# Altium schematic sheet PowerSupplies.SchDoc: Shepherd - Power Supplies
size 381 x 241 mm; Author: Ingmar; CompanyName: NES Lab / TU Dresden; DocumentNumber: 2; SheetNumber: 2; SheetTotal: 8
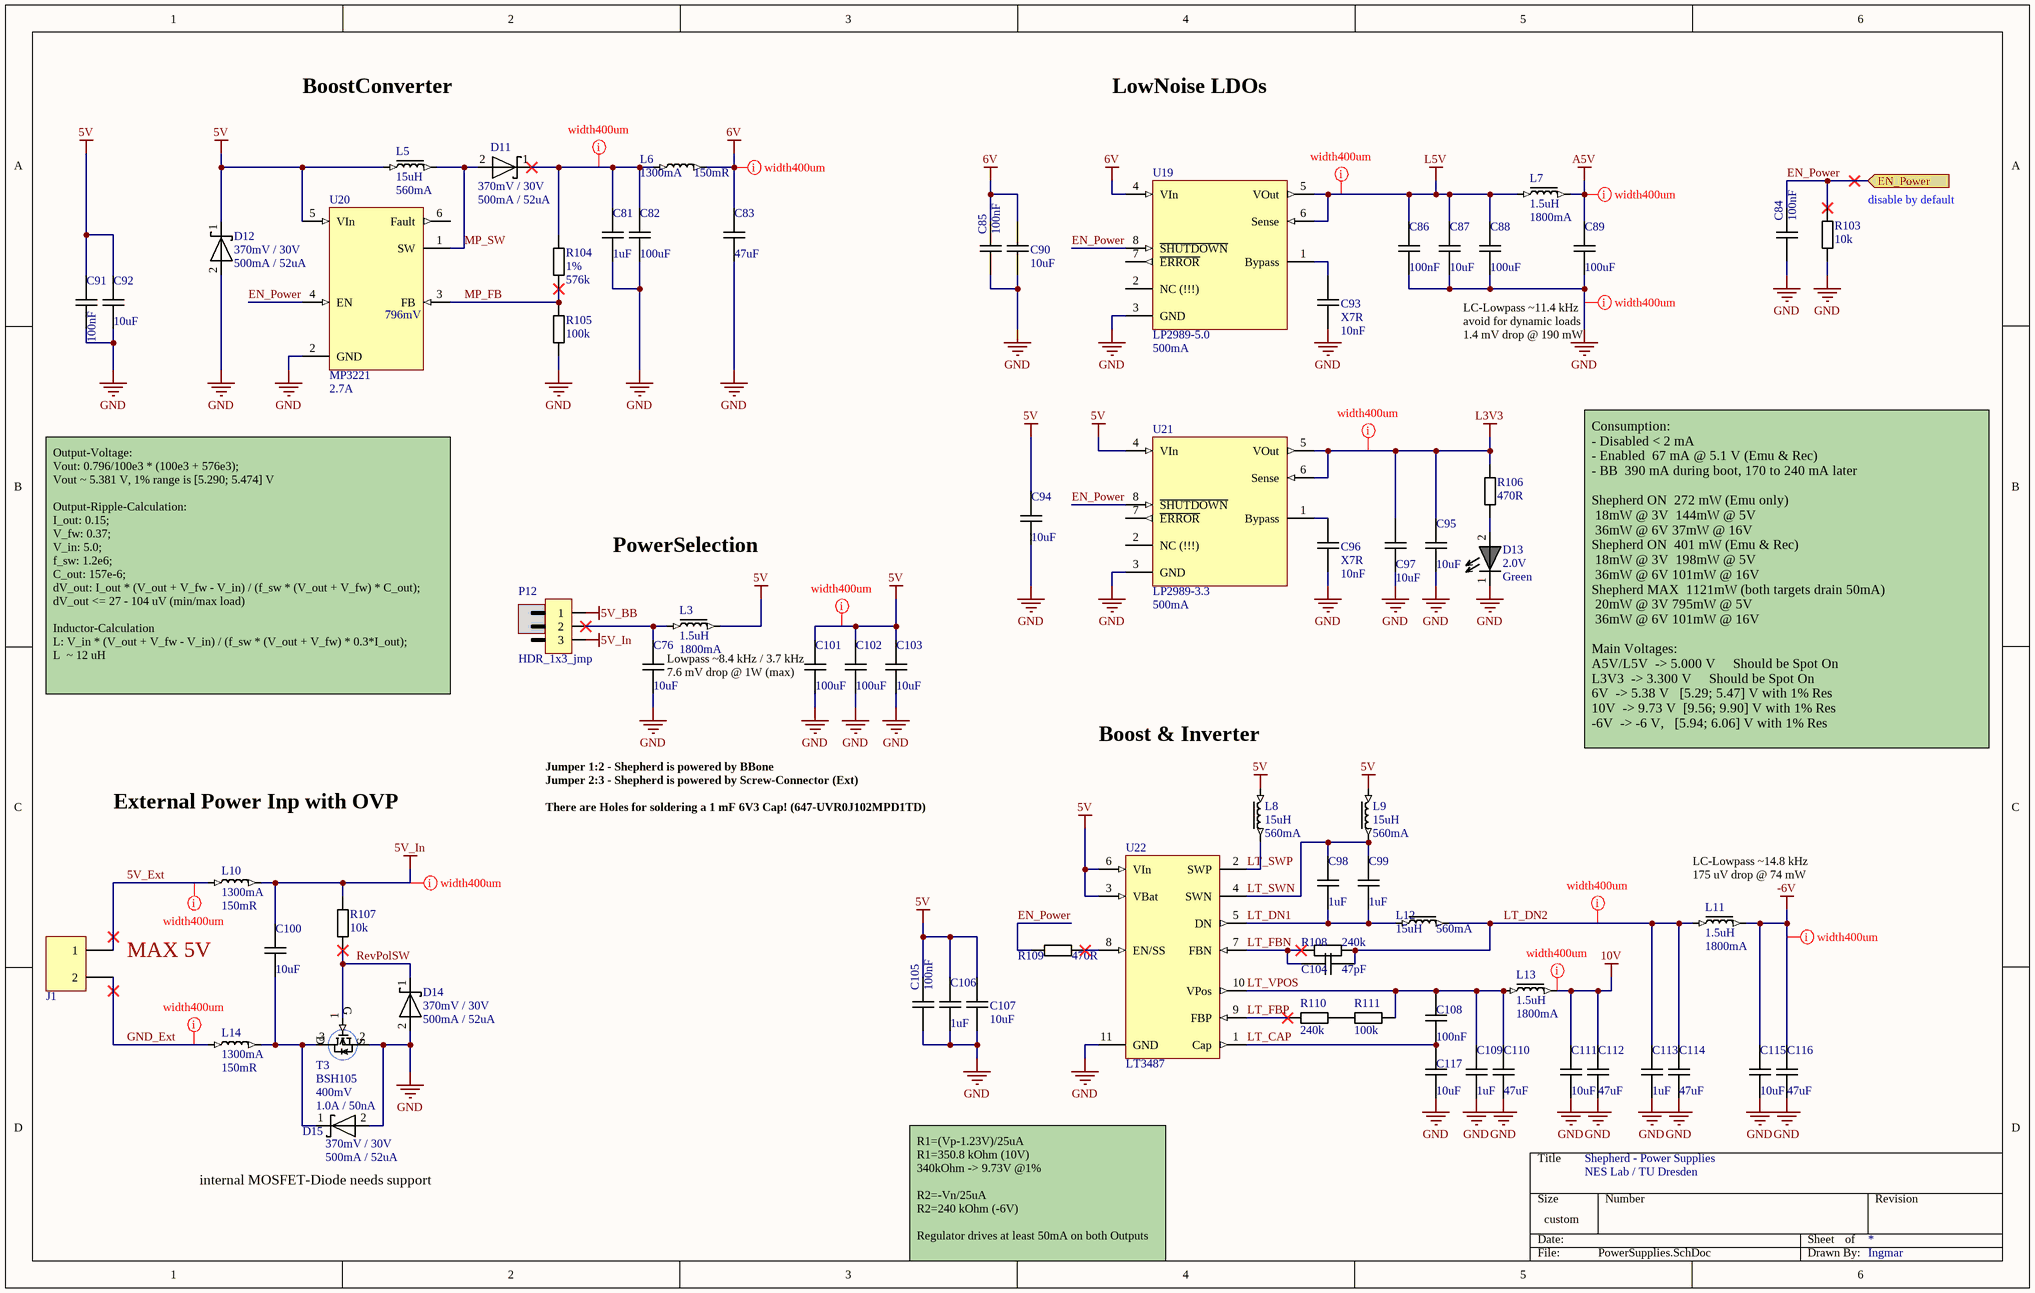
[diagram p0: PowerSupplies.SchDoc]

## Parts
C76  value 10uF  [CAPC1608X09]  (hidden comment: C_0603_10uF_16V)
C81  value 1uF  [CAPC1005X06]  (hidden comment: C_0402_1uF_25V)
C82  value 100uF  [CAPC3216X18]  (hidden comment: C_1206_100uF_6V3)
C83  value 47uF  [CAPC3216X18]  (hidden comment: C_1206_47uF_10V)
C84  value 100nF  [CAPC1005X06]  (hidden comment: C_0402_100nF_16V)
C85  value 100nF  [CAPC1005X06]  (hidden comment: C_0402_100nF_16V)
C86  value 100nF  [CAPC1005X06]  (hidden comment: C_0402_100nF_16V)
C87  value 10uF  [CAPC1608X09]  (hidden comment: C_0603_10uF_16V)
C88  value 100uF  [CAPC3216X18]  (hidden comment: C_1206_100uF_6V3)
C89  value 100uF  [CAPC3216X18]  (hidden comment: C_1206_100uF_6V3)
C90  value 10uF  [CAPC1608X09]  (hidden comment: C_0603_10uF_16V)
C91  value 100nF  [CAPC1005X06]  (hidden comment: C_0402_100nF_16V)
C92  value 10uF  [CAPC1608X09]  (hidden comment: C_0603_10uF_16V)
C93  value 10nF  Dielectric: X7R  [CAPC1005X06]  (hidden comment: C_0402_10nF_25V)
C94  value 10uF  [CAPC1608X09]  (hidden comment: C_0603_10uF_16V)
C95  value 10uF  [CAPC1608X09]  (hidden comment: C_0603_10uF_16V)
C96  value 10nF  Dielectric: X7R  [CAPC1005X06]  (hidden comment: C_0402_10nF_25V)
C97  value 10uF  [CAPC1608X09]  (hidden comment: C_0603_10uF_16V)
C98  value 1uF  [CAPC1005X06]  (hidden comment: C_0402_1uF_25V)
C99  value 1uF  [CAPC1005X06]  (hidden comment: C_0402_1uF_25V)
C100  value 10uF  [CAPC1608X09]  (hidden comment: C_0603_10uF_16V)
C101  value 100uF  [CAPC3216X18]  (hidden comment: C_1206_100uF_6V3)
C102  value 100uF  [CAPC3216X18]  (hidden comment: C_1206_100uF_6V3)
C103  value 10uF  [CAPC1608X09]  (hidden comment: C_0603_10uF_16V)
C104  value 47pF  [CAPC1005X06]  (hidden comment: C_0402_47pF_50V)
C105  value 100nF  [CAPC1005X06]  (hidden comment: C_0402_100nF_16V)
C106  value 1uF  [CAPC1005X06]  (hidden comment: C_0402_1uF_25V)
C107  value 10uF  [CAPC1608X09]  (hidden comment: C_0603_10uF_16V)
C108  value 100nF  [CAPC1005X06]  (hidden comment: C_0402_100nF_16V)
C109  value 1uF  [CAPC1005X06]  (hidden comment: C_0402_1uF_25V)
C110  value 47uF  [CAPC3216X18]  (hidden comment: C_1206_47uF_10V)
C111  value 10uF  [CAPC1608X09]  (hidden comment: C_0603_10uF_16V)
C112  value 47uF  [CAPC3216X18]  (hidden comment: C_1206_47uF_10V)
C113  value 1uF  [CAPC1005X06]  (hidden comment: C_0402_1uF_25V)
C114  value 47uF  [CAPC3216X18]  (hidden comment: C_1206_47uF_10V)
C115  value 10uF  [CAPC1608X09]  (hidden comment: C_0603_10uF_16V)
C116  value 47uF  [CAPC3216X18]  (hidden comment: C_1206_47uF_10V)
C117  value 10uF  [CAPC1608X09]  (hidden comment: C_0603_10uF_16V)
D11  value 370mV / 30V  I_max: 500mA / 52uA  [SODFL160X70-2N]  (hidden comment: D_SOD523_370mV_500mA)
D12  value 370mV / 30V  I_max: 500mA / 52uA  [SODFL160X70-2N]  (hidden comment: D_SOD523_370mV_500mA)
D13  value Green  V_max: 2.0V  [DIOM1608X02N Green]  (hidden comment: D_LED_0603_Green)
D14  value 370mV / 30V  I_max: 500mA / 52uA  [SODFL160X70-2N]  (hidden comment: D_SOD523_370mV_500mA)
D15  value 370mV / 30V  I_max: 500mA / 52uA  [SODFL160X70-2N]  (hidden comment: D_SOD523_370mV_500mA)
J1  J_T1x2_3.5mm_Screw  [P_Phoenix_1984617]  (value not drawn)
L3  value 1.5uH  I_max: 1800mA  [INDP3030X15N]  (hidden comment: NR3015T1R5M)
L5  value 15uH  I_max: 560mA  [INDP3030X15N]  (hidden comment: NR3015T150M)
L6  value 150mR  I_max: 1300mA  [INDC1608X08]  (hidden comment: FB_0603_Z600R_1300mA)
L7  value 1.5uH  I_max: 1800mA  [INDP3030X15N]  (hidden comment: NR3015T1R5M)
L8  value 15uH  I_max: 560mA  [INDP3030X15N]  (hidden comment: NR3015T150M)
L9  value 15uH  I_max: 560mA  [INDP3030X15N]  (hidden comment: NR3015T150M)
L10  value 150mR  I_max: 1300mA  [INDC1608X08]  (hidden comment: FB_0603_Z600R_1300mA)
L11  value 1.5uH  I_max: 1800mA  [INDP3030X15N]  (hidden comment: NR3015T1R5M)
L12  value 15uH  I_max: 560mA  [INDP3030X15N]  (hidden comment: NR3015T150M)
L13  value 1.5uH  I_max: 1800mA  [INDP3030X15N]  (hidden comment: NR3015T1R5M)
L14  value 150mR  I_max: 1300mA  [INDC1608X08]  (hidden comment: FB_0603_Z600R_1300mA)
P12  HDR_1x3_jmp  [P_Pinheader_1x3_R2.54mm_SMD]  (no BOM)
R103  value 10k  [RESC1005X04]  (hidden comment: R_0402_10k)
R104  value 576k  Tolerance: 1%  [RESC1005X04]  (hidden comment: R_0402_576k_1%)
R105  value 100k  [RESC1005X04]  (hidden comment: R_0402_100k_1%)
R106  value 470R  [RESC1005X04]  (hidden comment: R_0402_470R)
R107  value 10k  [RESC1005X04]  (hidden comment: R_0402_10k)
R108  value 240k  [RESC1005X04]  (hidden comment: R_0402_240k_1%)
R109  value 470R  [RESC1005X04]  (hidden comment: R_0402_470R)
R110  value 240k  [RESC1005X04]  (hidden comment: R_0402_240k_1%)
R111  value 100k  [RESC1005X04]  (hidden comment: R_0402_100k_1%)
T3  BSH105  V_min: 400mV  I_max: 1.0A / 50nA  [SOT95P230X110-3N]
U19  LP2989-5.0  I_max: 500mA  [TSOP65P490X110-8N]
U20  MP3221  I_max: 2.7A  [SOT95P280X100-6N]
U21  LP2989-3.3  I_max: 500mA  [TSOP65P490X110-8N]
U22  LT3487  [PSON50P300X100_HS-11N]

## Ports
EN_Power (in)

## Nets
5V: C91.2 C92.2 C94.2 C101.2 C102.2 C103.2 C105.2 C106.1 C107.2 D12.1 L3.2 L5.1 L8.1 L9.1 U20.5(VIn) U21.4(VIn) U22.3(VBat) U22.6(VIn)
5V_BB: P12.1
5V_In: C100.2 L10.2 P12.3 R107.2
6V: C83.2 C85.2 C90.2 L6.2 U19.4(VIn)
10V: C111.2 C112.2 L13.2
-6V: C115.2 C116.2 L11.2
A5V: C89.2 L7.2
GND: C76.1 C81.1 C82.1 C83.1 C84.1 C85.1 C86.1 C87.1 C88.1 C89.1 C90.1 C91.1 C92.1 C93.1 C94.1 C95.1 C96.1 C97.1 C101.1 C102.1 C103.1 C105.1 C106.2 C107.1 C109.1 C110.1 C111.1 C112.1 C113.1 C114.1 C115.1 C116.1 C117.1 D12.2 D13.1 D14.2 D15.2 R103.1 R105.1 T3.2(S) U19.3(GND) U20.2(GND) U21.3(GND) U22.11(GND)
L3V3: C95.2 C97.2 R106.2 U21.5(VOut) U21.6(Sense)
L5V: C86.2 C87.2 C88.2 L7.1 U19.5(VOut) U19.6(Sense)
5V_Ext: J1.1 L10.1
EN_Power: C84.2 R103.2 R109.2 U19.8(~{SHUTDOWN}) U20.4(EN) U21.8(~{SHUTDOWN}) ; port EN_Power
GND_Ext: J1.2 L14.1
LT_CAP: C108.1 C117.2 U22.1(Cap)
LT_DN1: C98.2 C99.1 L12.1 U22.5(DN)
LT_DN2: C104.2 C113.2 C114.2 L11.1 L12.2 R108.2
LT_FBN: C104.1 R108.1 U22.7(FBN)
LT_FBP: R110.1 U22.9(FBP)
LT_SWN: C98.1 C99.2 L9.2 U22.4(SWN)
LT_SWP: L8.2 U22.2(SWP)
LT_VPOS: C108.2 C109.2 C110.2 L13.1 R111.2 U22.10(VPos)
MP_FB: R104.1 R105.2 U20.3(FB)
MP_SW: D11.2 L5.2 U20.1(SW)
RevPolSW: D14.1 R107.1 T3.1(G)
NetC76_2: C76.2 L3.1 P12.2
NetC81_2: C81.2 C82.2 D11.1 L6.1 R104.2
NetC93_2: C93.2 U19.1(Bypass)
NetC96_2: C96.2 U21.1(Bypass)
NetC100_1: C100.1 D15.1 L14.2 T3.3(D)
NetD13_2: D13.2 R106.1
NetR109_1: R109.1 U22.8(EN/SS)
NetR110_2: R110.2 R111.1

Not connected (* = marked no-connect by the designer): U19 2(NC_(!!!)) 7(~{ERROR}); U20 6(Fault); U21 2(NC_(!!!)) 7(~{ERROR})

## Layout directives
rule Width Constraint [Pref Width = 0.4mm    Min Width = 0.4mm    Max Width = 1mm]; rule Supply Nets [Voltage = -6.000]: -6V
rule Width Constraint [Pref Width = 0.4mm    Min Width = 0.4mm    Max Width = 1mm]; rule Supply Nets [Voltage = 9.730]: 10V
rule Width Constraint [Pref Width = 0.4mm    Min Width = 0.4mm    Max Width = 1mm]; rule Supply Nets [Voltage = 5.000]: 5V, 5V_In, A5V, L5V
rule Width Constraint [Pref Width = 0.4mm    Min Width = 0.25mm    Max Width = 1mm]: GND
rule Width Constraint [Pref Width = 0.4mm    Min Width = 0.4mm    Max Width = 1mm]: 5V_Ext, GND_Ext, LT_DN2, NetC81_2
rule Width Constraint [Pref Width = 0.4mm    Min Width = 0.25mm    Max Width = 1mm]; rule Supply Nets [Voltage = 3.300]: L3V3
rule Width Constraint [Pref Width = 0.4mm    Min Width = 0.4mm    Max Width = 1mm]; rule Supply Nets [Voltage = 5.380]: 6V

## Notes on the sheet
- BoostConverter
- LowNoise LDOs
- (near R103) disable by default
- LC-Lowpass ~11.4 kHz
- avoid for dynamic loads
- 1.4 mV drop @ 190 mW
- PowerSelection
- Output-Voltage:
  Vout: 0.796/100e3 * (100e3 + 576e3);
  Vout ~ 5.381 V, 1% range is [5.290; 5.474] V
  Output-Ripple-Calculation:
  I_out: 0.15;
  V_fw: 0.37;
  V_in: 5.0;
  f_sw: 1.2e6;
  C_out: 157e-6;
  dV_out: I_out * (V_out + V_fw - V_in) / (f_sw * (V_out + V_fw) * C_out);
  dV_out <= 27 - 104 uV (min/max load)
  Inductor-Calculation
  L: V_in * (V_out + V_fw - V_in) / (f_sw * (V_out + V_fw) * 0.3*I_out);
  L  ~ 12 uH
- (near C101) Lowpass ~8.4 kHz / 3.7 kHz
- 7.6 mV drop @ 1W (max)
- Jumper 1:2 - Shepherd is powered by BBone
- Boost & Inverter
- Consumption:
  - Disabled < 2 mA
  - Enabled  67 mA @ 5.1 V (Emu & Rec)
  - BB  390 mA during boot, 170 to 240 mA later
  Shepherd ON  272 mW (Emu only)
  18mW @ 3V 	144mW @ 5V
  36mW @ 6V	37mW @ 16V
  Shepherd ON  401 mW (Emu & Rec)
  18mW @ 3V 	198mW @ 5V
  36mW @ 6V	101mW @ 16V
  Shepherd MAX  1121mW (both targets drain 50mA)
  20mW @ 3V	795mW @ 5V
  36mW @ 6V	101mW @ 16V
  Main Voltages:
  A5V/L5V 	-> 5.000 V    	Should be Spot On
  L3V3 	-> 3.300 V    	Should be Spot On
  6V 	-> 5.38 V 		[5.29; 5.47] V with 1% Res
  10V 	-> 9.73 V		[9.56; 9.90] V with 1% Res
  -6V 	-> -6 V, 		[5.94; 6.06] V with 1% Res
- External Power Inp with OVP
- Jumper 2:3 - Shepherd is powered by Screw-Connector (Ext)
- There are Holes for soldering a 1 mF 6V3 Cap! (647-UVR0J102MPD1TD)
- LC-Lowpass ~14.8 kHz
- (near L11) 175 uV drop @ 74 mW
- MAX 5V
- (near D15) internal MOSFET-Diode needs support
- R1=(Vp-1.23V)/25uA
  R1=350.8 kOhm (10V)
  340kOhm -> 9.73V @1%
  R2=-Vn/25uA
  R2=240 kOhm (-6V)
  Regulator drives at least 50mA on both Outputs
- (in symbol MP3221) 796mV

## Library data of the parts
C76 C87 C90 C92 C94 C95 C97 C100 C103 C107 C111 C115 C117 = .C_0603_10uF_16V: Capacitor; Manufacturer: Taiyo Yuden; Manufacturer PN: EMK107BBJ106MA-T; V_max: 16V; Tolerance: 20%; Dielectric: X5R; Distributer: Mouser; Distributer PN: 963-EMK107BBJ106MA-T; Price n10 [€]: 0.14
C81 C98 C99 C106 C109 C113 = .C_0402_1uF_25V: Capacitor; Manufacturer: Murata; Manufacturer PN: GRM155R61E105KA12J; V_max: 25V; Tolerance: 10%; Dielectric: X5R; Distributer: Mouser; Distributer PN: 81-GRM155R61E105KA2J; Price n10 [€]: 0.06
C82 C88 C89 C101 C102 = .C_1206_100uF_6V3: Capacitor; Manufacturer: Taiyo Yuden; Manufacturer PN: JMK316ABJ107ML-T; V_max: 6V3; Tolerance: 20%; Dielectric: X5R; Distributer: Mouser; Distributer PN: 963-JMK316ABJ107ML-T; Price n10 [€]: 0.25
C83 C110 C112 C114 C116 = .C_1206_47uF_10V: Capacitor; Manufacturer: Taiyo Yuden; Manufacturer PN: LMK316ABJ476ML-T; V_max: 10V; Tolerance: 20%; Dielectric: X5R; Distributer: Mouser; Distributer PN: 963-LMK316ABJ476ML-T; Price n10 [€]: 0.23
C84-C86 C91 C105 C108 = .C_0402_100nF_16V: Capacitor; Manufacturer: Taiyo Yuden; Manufacturer PN: EMF105B7104MVHF; V_max: 16V; Tolerance: 20%; Dielectric: X7R; Distributer: Mouser; Distributer PN: 963-EMF105B7104MVHF; Price n10 [€]: 0.03
C93 C96 = .C_0402_10nF_25V: Capacitor; Manufacturer: Murata; Manufacturer PN: GCM155R71E103KA37D; V_max: 25V; Tolerance: 10%; Distributer: Mouser; Distributer PN: 81-GCM155R71E103KA7D; Price n10 [€]: 0.02
C104 = .C_0402_47pF_50V: Capacitor; Manufacturer: Kemet; Manufacturer PN: C0402C470K5GACTU; V_max: 50V; Tolerance: 10%; Dielectric: C0G; Distributer: Mouser; Distributer PN: 80-C0402C470K5G; Price n10 [€]: 0.01
D11 D12 D14 D15 = .D_SOD523_370mV_500mA: Diode Si, 370mV 500mA forward, 30V 52uA reverse, 3 A Surge,; Manufacturer: On Semi; Manufacturer PN: NSR05T30XV2T5G; P_max: 350mW; Distributer: Mouser; Distributer PN: 863-NSR05T30XV2T5G; Price n10 [€]: 0.18
D13 = .D_LED_0603_Green: LED YellowGreen 575nm, 0603, 60mcd 2V@20mA; Manufacturer: Wuerth; Manufacturer PN: 150060VS55040; I_max: 20mA; I_typ: 5mA; V_typ: 1.85V; Distributer: Mouser; Distributer PN: 710-150060VS55040; Price n10 [€]: 0.14
J1 = .J_T1x2_3.5mm_Screw: Fixed Terminal Block, Screw; Manufacturer: Phoenix Contact; Manufacturer PN: 1984617; I_max: 17A; V_max: 160V; Distributer: Mouser; Distributer PN: 651-1984617; Price n10 [€]: 0.39
L3 L7 L11 L13 = .L_NR3015T1R5M: Inductor, fixed, shielded, 38 mOhm; Manufacturer: Taiyo Yuden; Manufacturer PN: NR3015T1R5N; Tolerance: 20 %; Distributer: Mouser; Distributer PN: 963-NR3015T1R5N; Price n10 [€]: 0.20
L5 L8 L9 L12 = .L_NR3015T150M: Inductor, fixed, shielded, 432 mOhm; Manufacturer: Taiyo Yuden; Tolerance: 20; Distributer: Mouser; Distributer PN: 963-NR3015T150M; Manufacturer PN: NR3015T150M; Price n10 [€]: 0.23
L6 L10 L14 = .L_FB_0603_Z600R_1300mA: Ferrite Bead, 600 Ohm @ 100 MHz,; Manufacturer: Murata; Manufacturer PN: BLM18KG601SN1D; Tolerance: 25 %; Distributer: Mouser; Distributer PN: 81-BLM18KG601SN1D; Price n10 [€]: 0.05
P12 = .P_HDR_1x3_2.54mm_jumper: Gold; Distributer: Mouser
R103 R107 = .R_0402_10k: Resistor; Manufacturer: Panasonic; Manufacturer PN: ERJ-2GEJ103X; P_max: 100mW; V_max: 50V; Tolerance: 5%; Distributer: Mouser; Distributer PN: 667-ERJ-2GEJ103X; Price n10 [€]: 0.02
R104 = .R_0402_576k_1%: Resistor 100ppm/K; Manufacturer: Panasonic; Manufacturer PN: ERJ-2RKF5763X; P_max: 100mW; V_max: 50V; Distributer: Mouser; Distributer PN: 667-ERJ-2RKF5763X; Price n10 [€]: 0.02
R105 R111 = .R_0402_100k: Resistor; Manufacturer: Panasonic; Manufacturer PN: ERJ-2RKF1003X; P_max: 100mW; V_max: 50V; Tolerance: 1%; Distributer: Mouser; Distributer PN: 667-ERJ-2RKF1003X; Price n10 [€]: 0.02
R106 R109 = .R_0402_470R: Resistor; Manufacturer: Panasonic; Manufacturer PN: ERJ-2GEJ471X; P_max: 100mW; V_max: 50V; Tolerance: 5%; Distributer: Mouser; Distributer PN: 667-ERJ-2GEJ471X; Price n10 [€]: 0.02
R108 R110 = .R_0402_240k_1%: Resistor 100ppm/C; Manufacturer: Panasonic; Manufacturer PN: ERJ-2RKF2403X; P_max: 100mW; V_max: 50V; Tolerance: 1%; Distributer: Mouser; Distributer PN: 667-ERJ-2RKF2403X; Price n10 [€]: 0.02
T3 = .T_BSH105: Transistor, nMosfet, 20 V Vds, 250 mOhm Rds, +-8V Vgs, 20 ns Fall, 4.5 ns Rise, 3.9 nC Qg, 50 nA Drain Leakage (Vds=16, Vgs=0); Manufacturer: Nexperia; Manufacturer PN: BSH105,215; V_max: 20V; P_max: 410mW; Distributer: Mouser; Distributer PN: 771-BSH105215; Price n10 [€]: 0.21; R_min: 250mOhm
U19 = LP2989-5.0: VoltageRegulator, UltraLowNoise LDO, 500mA, 60 dB RippleRejection, 18 uV RMS Noise,; Manufacturer: TI; Manufacturer PN: LP2989AIMM-5.0/NOPB; V_max: 16V; V_min: 2.1V; Distributer: Mouser; Distributer PN: 926-LP2989AIMM50NOPB; Price n10 [€]: 2.05
U20 = MP3221: VoltageRegulator, 1.2 MHz Boost with integrated 88 mOhm Mosfet, 270 uA quiescent, 3-6V Output; Manufacturer: MPS; Manufacturer PN: MP3221GJ-Z; V_max: 6V; V_min: 2,5V; Distributer: Mouser; Distributer PN: 946-MP3221GJ-Z; Price n10 [€]: 1.33
U21 = LP2989-3.3: VoltageRegulator, UltraLowNoise LDO, 500mA, 60 dB RippleRejection, 18 uV RMS Noise,; Manufacturer: TI; Manufacturer PN: LP2989IMM-3.3/NOPB; V_max: 16V; V_min: 2.1V; Distributer: Mouser; Distributer PN: 926-LP2989IMM3.3NOPB; Price n10 [€]: 2.27
U22 = LT3487: Voltage Regulator, Switching, Boost and Inverting, 2MHz / R1=(Vp-1.23V)/25uA / R2=-Vn/25uA; Manufacturer: Analog; Manufacturer PN: LT3487EDD#TRPBF; I_max: 3.7mA; V_max: 16V; V_min: 2.3V; Distributer: Mouser; Distributer PN: 584-LT3487EDD#TRPBF; Price n10 [€]: 2.72